# Altium schematic sheet 02_power_supply.SchDoc
size A3; SheetNumber: 6; SheetTotal: 17
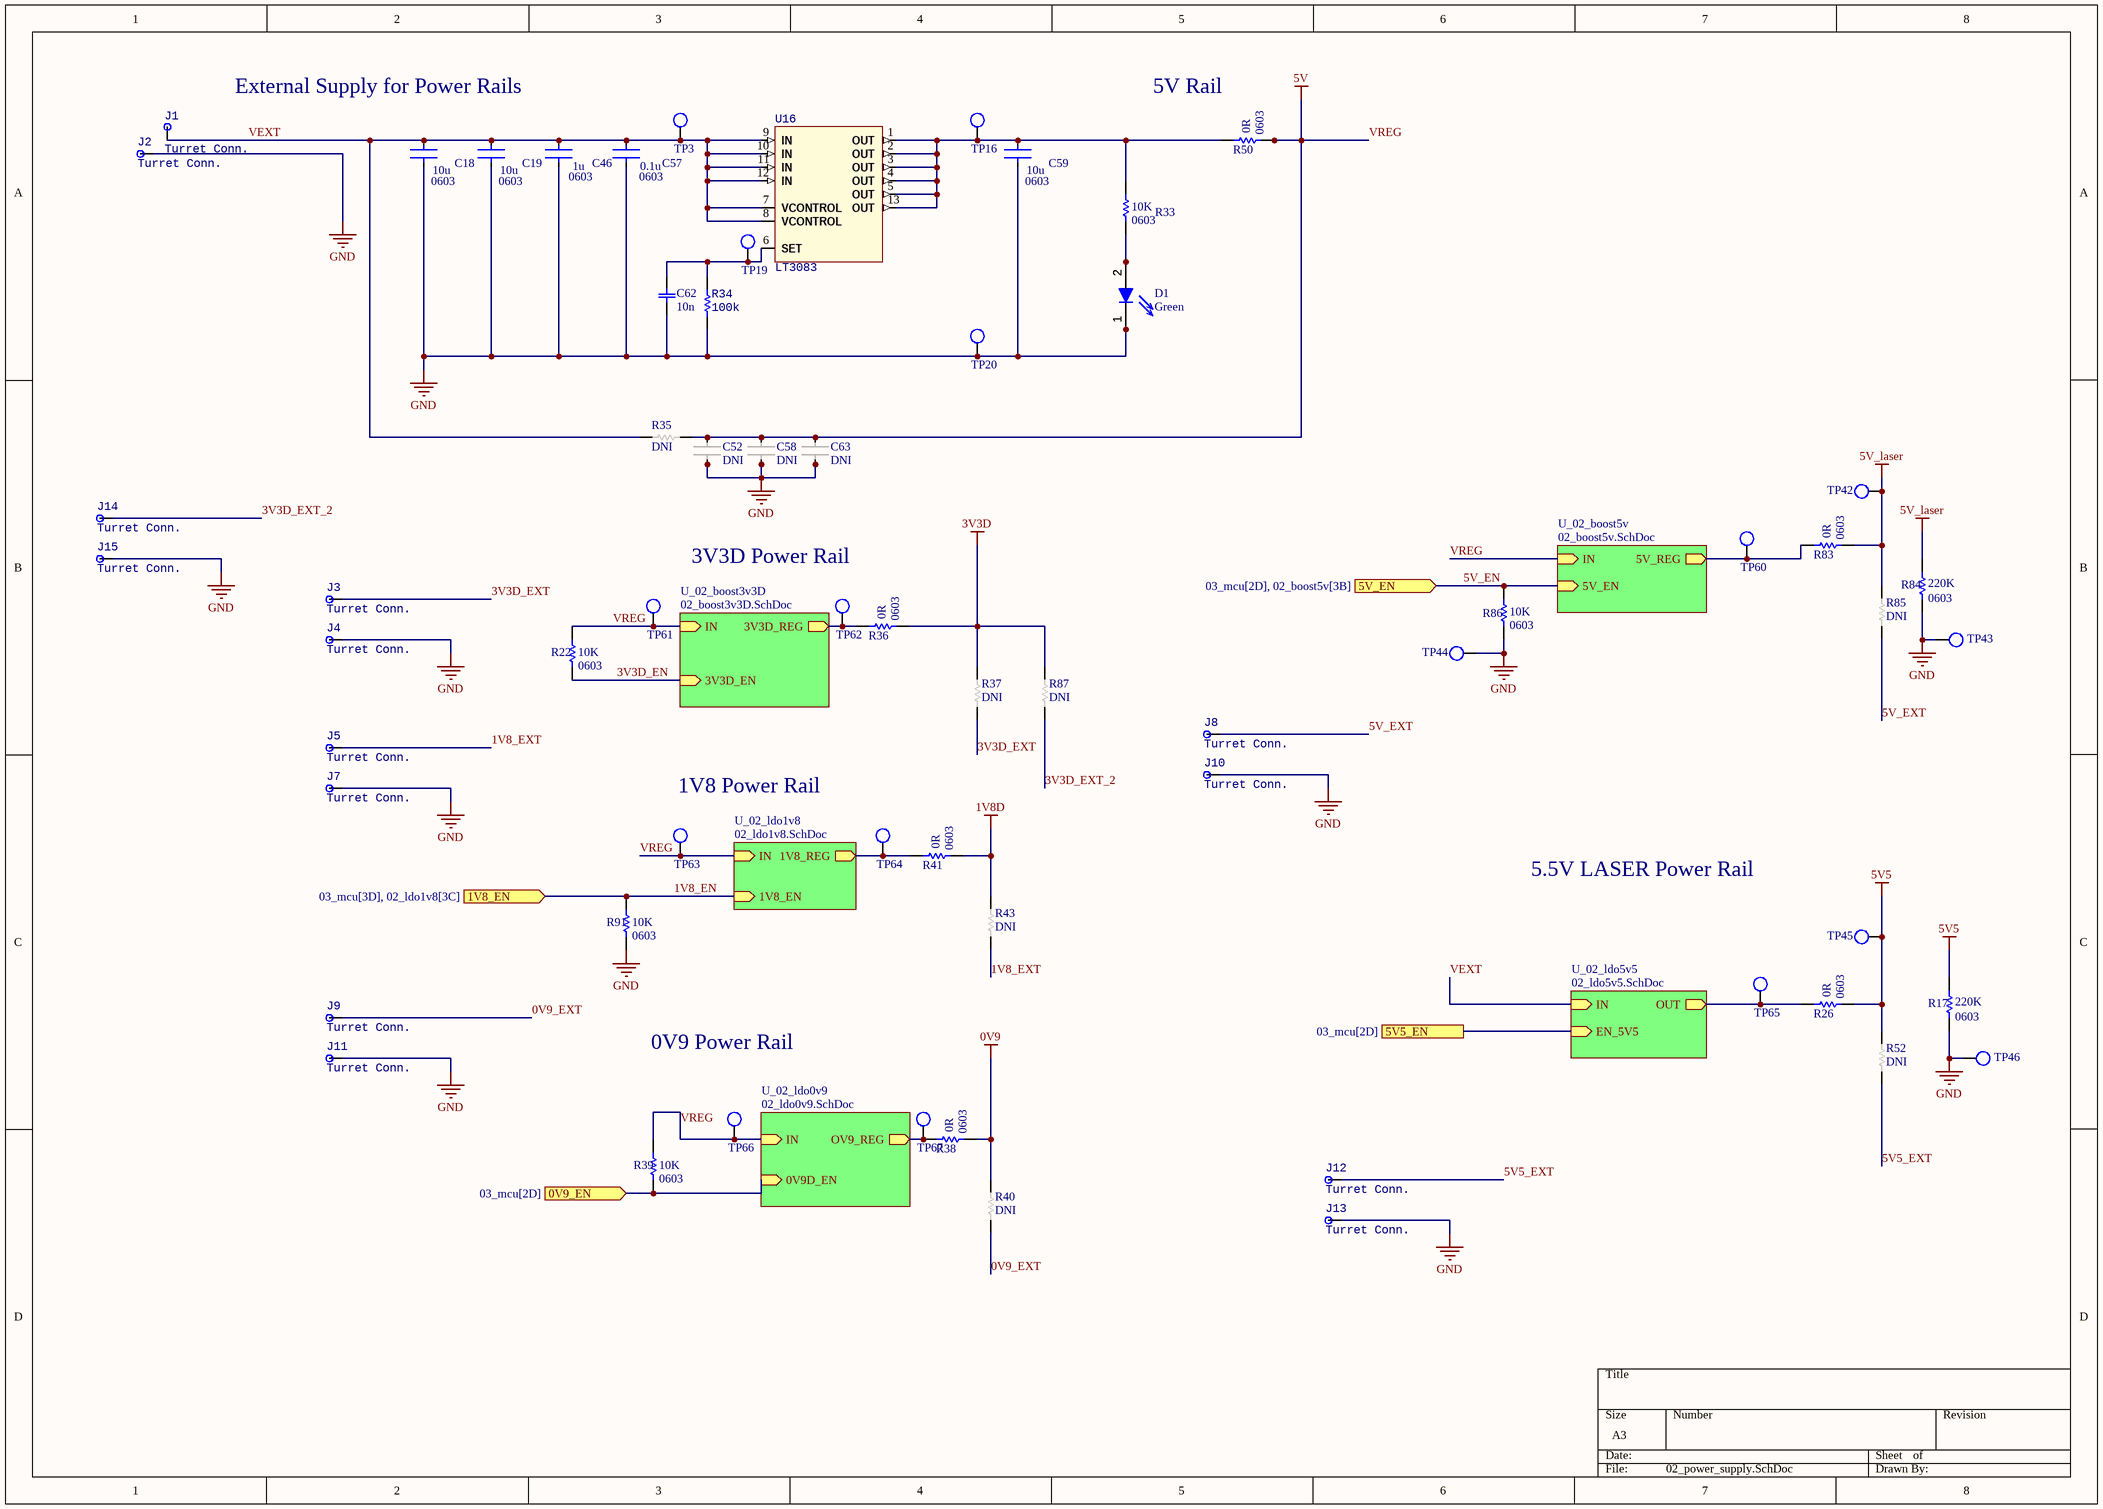
[diagram p0: 02_power_supply.SchDoc]

## Parts
C18  C1608X5R1A106K080AC  [CAPTDK0603]  (value not drawn)
C19  C1608X5R1A106K080AC  [CAPTDK0603]  (value not drawn)
C46  C1608X5R1E105K080AC  [CAPTDK0603]  (value not drawn)
C52  DNI  [CAPTDK0603]  (no BOM)
C57  CGA3E2X7R1H104K080AA  [CAPTDK0603]  (value not drawn)
C58  DNI  [CAPTDK0603]  (no BOM)
C59  C1608X5R1A106K080AC  [CAPTDK0603]  (value not drawn)
C62  10n  [CAP_CL10]
C63  DNI  [CAPTDK0603]  (no BOM)
D1  Green  [DISPLAY-LED]
J1  Turret Conn.  [2501-X]
J2  Turret Conn.  [2501-X]
J3  Turret Conn.  [2501-X]
J4  Turret Conn.  [2501-X]
J5  Turret Conn.  [2501-X]
J7  Turret Conn.  [2501-X]
J8  Turret Conn.  [2501-X]
J9  Turret Conn.  [2501-X]
J10  Turret Conn.  [2501-X]
J11  Turret Conn.  [2501-X]
J12  Turret Conn.  [2501-X]
J13  Turret Conn.  [2501-X]
J14  Turret Conn.  [2501-X]
J15  Turret Conn.  [2501-X]
R17  RMCF0603FT220K  [RES-STACK-POLE-0603]  (value not drawn)
R22  RMCF0603JG10K0  [RES-STACK-POLE-0603]  (value not drawn)
R26  RMCF0603ZT0R00  [RES-STACK-POLE-0603]  (value not drawn)
R33  RMCF0603JG10K0  [RES-STACK-POLE-0603]  (value not drawn)
R34  100k  [RES_0603]
R35  DNI  [RES_0603]
R36  RMCF0603ZT0R00  [RES-STACK-POLE-0603]  (value not drawn)
R37  DNI  [RES_0603]
R38  RMCF0603ZT0R00  [RES-STACK-POLE-0603]  (value not drawn)
R39  RMCF0603JG10K0  [RES-STACK-POLE-0603]  (value not drawn)
R40  DNI  [RES_0603]
R41  RMCF0603ZT0R00  [RES-STACK-POLE-0603]  (value not drawn)
R43  DNI  [RES_0603]
R50  RMCF0603ZT0R00  [RES-STACK-POLE-0603]  (value not drawn)
R52  DNI  [RES_0603]
R83  RMCF0603ZT0R00  [RES-STACK-POLE-0603]  (value not drawn)
R84  RMCF0603FT220K  [RES-STACK-POLE-0603]  (value not drawn)
R85  DNI  [RES_0603]
R86  RMCF0603JG10K0  [RES-STACK-POLE-0603]  (value not drawn)
R87  DNI  [RES_0603]
R91  RMCF0603JG10K0  [RES-STACK-POLE-0603]  (value not drawn)
TP3  TESTPOINT_S  [TESTPOINT_S]  (value not drawn)  (no BOM)
TP16  TESTPOINT_S  [TESTPOINT_S]  (value not drawn)  (no BOM)
TP19  TESTPOINT_S  [TESTPOINT_S]  (value not drawn)  (no BOM)
TP20  TESTPOINT_S  [TESTPOINT_S]  (value not drawn)  (no BOM)
TP42  TESTPOINT_S  [TESTPOINT_S]  (value not drawn)  (no BOM)
TP43  TESTPOINT_S  [TESTPOINT_S]  (value not drawn)  (no BOM)
TP44  TESTPOINT_S  [TESTPOINT_S]  (value not drawn)  (no BOM)
TP45  TESTPOINT_S  [TESTPOINT_S]  (value not drawn)  (no BOM)
TP46  TESTPOINT_S  [TESTPOINT_S]  (value not drawn)  (no BOM)
TP60  TESTPOINT_S  [TESTPOINT_S]  (value not drawn)  (no BOM)
TP61  TESTPOINT_S  [TESTPOINT_S]  (value not drawn)  (no BOM)
TP62  TESTPOINT_S  [TESTPOINT_S]  (value not drawn)  (no BOM)
TP63  TESTPOINT_S  [TESTPOINT_S]  (value not drawn)  (no BOM)
TP64  TESTPOINT_S  [TESTPOINT_S]  (value not drawn)  (no BOM)
TP65  TESTPOINT_S  [TESTPOINT_S]  (value not drawn)  (no BOM)
TP66  TESTPOINT_S  [TESTPOINT_S]  (value not drawn)  (no BOM)
TP67  TESTPOINT_S  [TESTPOINT_S]  (value not drawn)  (no BOM)
U16  LT3083  [DF-12_LT3083]

## Sub-sheets
U_02_boost3v3D = 02_boost3v3D.SchDoc: IN (in), 3V3D_EN (in), 3V3D_REG (out)
U_02_boost5v = 02_boost5v.SchDoc: IN (in), 5V_EN (in), 5V_REG (out)
U_02_ldo0v9 = 02_ldo0v9.SchDoc: IN (in), 0V9D_EN (in), OV9_REG (out)
U_02_ldo1v8 = 02_ldo1v8.SchDoc: IN (in), 1V8_EN (in), 1V8_REG (out)
U_02_ldo5v5 = 02_ldo5v5.SchDoc: IN (in), OUT (out), EN_5V5 (in)

## Ports
0V9_EN (in, see 03_mcu[2D]), 1V8_EN (in, see 03_mcu[3D], 02_ldo1v8[3C]), 5V5_EN (see 03_mcu[2D]), 5V_EN (in, see 03_mcu[2D], 02_boost5v[3B])

## Nets
0V9: R38.1 R40.1
1V8D: R41.1 R43.1
3V3D: R36.1 R37.1 R87.1
5V5: R17.2 R26.1 R52.1 TP45.1
5V_laser: R83.1 R84.2 R85.1 TP42.1
GND: C18.2 C19.2 C46.2 C52.2 C57.2 C58.2 C59.2 C62.1 C63.2 D1.1 J2.1 J4.1 J7.1 J10.1 J11.1 J13.1 J15.1 R17.1 R34.1 R84.1 R86.1 R91.1 TP20.1 TP43.1 TP44.1 TP46.1
VREG: C52.1 C58.1 C63.1 R22.2 R35.2 R39.2 R50.1 TP61.1 TP63.1 TP66.1 ; sheet U_02_ldo1v8/IN, sheet U_02_boost3v3D/IN, sheet U_02_ldo0v9/IN, sheet U_02_boost5v/IN  [also labelled 5V]
0V9_EN: R39.1 ; port 0V9_EN, sheet U_02_ldo0v9/0V9D_EN
0V9_EXT: J9.1 R40.2
1V8_EN: R91.2 ; port 1V8_EN, sheet U_02_ldo1v8/1V8_EN
1V8_EXT: J5.1 R43.2
3V3D_EN: R22.1 ; sheet U_02_boost3v3D/3V3D_EN
3V3D_EXT: J3.1 R37.2
3V3D_EXT_2: J14.1 R87.2
5V5_EN: port 5V5_EN, sheet U_02_ldo5v5/EN_5V5
5V5_EXT: J12.1 R52.2
5V_EN: R86.2 ; port 5V_EN, sheet U_02_boost5v/5V_EN
5V_EXT: J8.1 R85.2
VEXT: C18.1 C19.1 C46.1 C57.1 J1.1 R35.1 TP3.1 U16.7(VCONTROL) U16.8(VCONTROL) U16.9(IN) U16.10(IN) U16.11(IN) U16.12(IN) ; sheet U_02_ldo5v5/IN
NetC59_1: C59.1 R33.2 R50.2 TP16.1 U16.1(OUT) U16.2(OUT) U16.3(OUT) U16.4(OUT) U16.5(OUT) U16.13(OUT)
NetC62_2: C62.2 R34.2 TP19.1 U16.6(SET)
NetD1_2: D1.2 R33.1
NetR26_2: R26.2 TP65.1 ; sheet U_02_ldo5v5/OUT
NetR36_2: R36.2 TP62.1 ; sheet U_02_boost3v3D/3V3D_REG
NetR38_2: R38.2 TP67.1 ; sheet U_02_ldo0v9/OV9_REG
NetR41_2: R41.2 TP64.1 ; sheet U_02_ldo1v8/1V8_REG
NetR83_2: R83.2 TP60.1 ; sheet U_02_boost5v/5V_REG

## Notes on the sheet
- External Supply for Power Rails
- (near R50) 5V Rail
- 3V3D Power Rail
- 1V8 Power Rail
- 5.5V LASER Power Rail
- 0V9 Power Rail
- (in symbol C1608X5R1A106K080AC) 10u; 0603
- (in symbol C1608X5R1E105K080AC) 1u; 0603
- (in symbol CGA3E2X7R1H104K080AA) 0.1u; 0603
- (in symbol RMCF0603FT220K) 220K; 0603
- (in symbol RMCF0603JG10K0) 10K; 0603
- (in symbol RMCF0603ZT0R00) 0R; 0603

## Library data of the parts
C18 C19 C59 = C1608X5R1A106K080AC: CAP CER 10UF 10V X5R 0603; Supplier 1: Digi-Key; Supplier Part Number 1: 445-C1608X5R1A106K080ACCT-ND
C46 = C1608X5R1E105K080AC: CAP CER 1UF 25V X5R 0603; Supplier 1: Digi-Key; Supplier Part Number 1: 445-5146-1-ND
C52 C58 C63 = C0402_PROVISION: CAP PROVISION 0603; Value: DNI
C57 = CGA3E2X7R1H104K080AA: CAP CER 0.1UF 50V X7R 0603; Supplier 1: Digi-Key; Supplier Part Number 1: 445-5666-1-ND
C62 = CC0603KRX7R9BB103: CAP CER 10NF 50V X7R 0603; Manufacturer: Yageo; Material: Ceramic; Tolerance: 10%; Insulation Resistance: 100GR; Supplier 1: Digi-Key; Manufacturer Part Number: CC0603KRX7R9BB103; RoHS: Yes; Category: Ceramic Capacitors; Stock 1: 11591344; Pricing 1: 4000=0.00734, 8000=0.00670 (USD); Mount: Surface Mount; Case/Package: 0603; Number of Pins: 2; Case Code (Metric): 1608; Case Code (Imperial): 0603; Min Operating Temperature: -55°C; Max Operating Temperature: 125°C; Capacitance: 10nF; Dielectric: X7R; Voltage: 50V; Packaging: Tape and Reel; Voltage Rating: 50V; Voltage Rating (DC): 50V; Package Quantity: 1; Termination: SMD/SMT; Resistor Type: Ceramic; Series: CC; Length: 1.6mm; Width: 0.031inch; Height: 0.8mm; Thickness: 0.035inch; Depth: 0.8mm; Radiation Hardening: No; RoHS Compliant: Yes; REACH SVHC: No SVHC; Lead Free: Lead Free; Halogen Free: Halogen Free; ComponentLink1URL: https://datasheet.ciiva.com/11788/0900766b8079c870-11788374.pdf?src-supplier=RSComponents; ComponentLink1Description: https://datasheet.ciiva.com/11788/0900766b8079c870-11788374.pdf?src-supplier=RSComponents; ComponentLink2URL: https://datasheet.ciiva.com/26862/getdatasheetpartid-403582-26862846.pdf?src-supplier=Verical; ComponentLink2Description: https://datasheet.ciiva.com/26862/getdatasheetpartid-403582-26862846.pdf?src-supplier=Verical; ComponentLink3URL: https://datasheet.ciiva.com/8033/70765-8033817.pdf?src-supplier=Element14; ComponentLink3Description: https://datasheet.ciiva.com/8033/70765-8033817.pdf?src-supplier=Element14; ComponentLink4URL: https://datasheet.ciiva.com/28450/1489800-28450619.pdf?src-supplier=Element14; ComponentLink4Description: https://datasheet.ciiva.com/28450/1489800-28450619.pdf?src-supplier=Element14; ComponentLink5URL: https://datasheet.ciiva.com/176/mlccorderingcode-176551.pdf?src-supplier=Digi-Key; ComponentLink5Description: https://datasheet.ciiva.com/176/mlccorderingcode-176551.pdf?src-supplier=Digi-Key; ComponentLink6URL: https://datasheet.ciiva.com/176/mlccorderingcode-176550.pdf?src-supplier=Digi-Key; ComponentLink6Description: https://datasheet.ciiva.com/176/mlccorderingcode-176550.pdf?src-supplier=Digi-Key; ComponentLink7URL: https://datasheet.ciiva.com/176/mlccorderingcode-176552.pdf?src-supplier=Digi-Key; ComponentLink7Description: https://datasheet.ciiva.com/176/mlccorderingcode-176552.pdf?src-supplier=Digi-Key; ComponentLink8URL: https://datasheet.ciiva.com/13389/upy-gphc-x7r-6-3v-to-50v-8-13389991.pdf?src-supplier=Mouser; ComponentLink8Description: https://datasheet.ciiva.com/13389/upy-gphc-x7r-6-3v-to-50v-8-13389991.pdf?src-supplier=Mouser; ComponentLink9URL: https://datasheet.ciiva.com/8033/1734573-8033816.pdf?src-supplier=Element14; ComponentLink9Description: https://datasheet.ciiva.com/8033/1734573-8033816.pdf?src-supplier=Element14; ComponentLink10URL: https://datasheet.ciiva.com/8033/1734573-8033861.pdf?src-supplier=Element14; ComponentLink10Description: https://datasheet.ciiva.com/8033/1734573-8033861.pdf?src-supplier=Element14; ComponentLink11URL: https://datasheet.ciiva.com/16625/upy-gphc-x7r-6-3v-to-50v-8-16625529.pdf?src-supplier=Avnet+Europe; ComponentLink11Description: https://datasheet.ciiva.com/16625/upy-gphc-x7r-6-3v-to-50v-8-16625529.pdf?src-supplier=Avnet+Europe; Supplier Part Number 1: 311-1085-2-ND; Value: 10nF
D1 = LTST-C191KGKT: LED GREEN CLEAR 0603  SMD; Supplier 1: Digi-Key; Supplier Part Number 1: 160-1446-1-ND
J1-J5 J7-J15 = 2501-2-00-80-00-00-07-0: TERM TURRET SINGLE L=5.56MM TIN; Manufacturer: Mill-Max; Gender: Male; Outside Diameter: 3.18mm; Hole Diameter: 0.094inch; Board Thickness: 1.57mm; Mounting Hole Diameter: 2.39mm; Pin Diameter: 0.047inch; Supplier 1: Digi-Key; Manufacturer Part Number: 2501-2-00-80-00-00-07-0; RoHS: Yes; Category: Terminals; Stock 1: 31575; Pricing 1: 1=0.26000, 10=0.22000, 25=0.19520, 50=0.18200, 100=0.16900, 250=0.14952, 500=0.14300, 1000=0.11701, 2500=0.10726 (USD); Mount: Through Hole; Material: Brass; Plating: Tin; Package Quantity: 500; Packaging: Bulk; Length: 0.328inch; Lead Free: Lead Free; RoHS Compliant: Yes; ComponentLink1URL: https://datasheet.ciiva.com/12487/2501-2-00-80-00-00-07-0-89719-12487471.pdf?src-supplier=Mouser; ComponentLink1Description: https://datasheet.ciiva.com/12487/2501-2-00-80-00-00-07-0-89719-12487471.pdf?src-supplier=Mouser; Supplier Part Number 1: ED90581-ND
R17 R84 = RMCF0603FT220K: RES 220K OHM 1% 1/10W 0603; Supplier 1: Digi-Key; Supplier Part Number 1: RMCF0603FT220KCT-ND
R22 R33 R39 R86 R91 = RMCF0603JG10K0: RES 10K OHM 5% 1/10W 0603; Supplier 1: Digi-Key; Supplier Part Number 1: 738-RMCF0603JG10K0CT-ND
R26 R36 R38 R41 R50 R83 = RMCF0603ZT0R00: RES 0 OHM JUMPER 1/10W 0603; Supplier 1: Digi-Key; Supplier Part Number 1: RMCF0603ZT0R00CT-ND
R34 = RMCF0603FT100K_1: RES 100K OHM 1% 1/10W 0603; Manufacturer: Stackpole Electronics; Resistance: 100kR; Power Rating: 100mW; Temperature Coefficient: 100ppm/°C; Working Voltage: 75V; Supplier 1: Digi-Key; Manufacturer Part Number: RMCF0603FT100K; RoHS: Yes; Category: Chip SMD Resistors; Stock 1: 8267885; Pricing 1: 1=0.10000, 10=0.01700, 100=0.00680, 1000=0.00305, 2500=0.00264 (USD); Mount: Surface Mount; Case/Package: 0603; Case Code (Metric): 1608; Case Code (Imperial): 0603; Contact Plating: Tin,Matte; Min Operating Temperature: -55°C; Max Operating Temperature: 155°C; Packaging: Tape and Reel; Series: RMCF; Tolerance: 1%; Resistor Type: Thick Film; Number of Terminations: 2; Max Power Dissipation: 100mW; Features: Automotive AEC-Q200; Construction: Rectangular; Length: 1.55mm; Width: 0.031inch; Height: 0.022inch; Depth: 0.8mm; Radiation Hardening: No; Military Standard: Not; Lead Free: Lead Free; RoHS Compliant: Yes; ComponentLink1URL: https://datasheet.ciiva.com/15193/getdatasheetpartid-362597-15193437.pdf?src-supplier=Verical; ComponentLink1Description: https://datasheet.ciiva.com/15193/getdatasheetpartid-362597-15193437.pdf?src-supplier=Verical; Supplier Part Number 1: RMCF0603FT100KCT-ND
R35 R37 R40 R43 R52 R85 R87 = R0603: RES DNI 0603
TP3 TP16 TP19 TP20 TP42-TP46 TP60-TP67 = TESTPOINT_S: Testpoint Surface Pad
U16 = LT3083EDF#PBF: IC REG LINEAR POS ADJ 3A 12DFN; Supplier 1: Digikey; Supplier Part Number 1: 505-LT3083EDF#PBF-ND